# Altium project R5560_Test_Board_rev1.PrjPcb
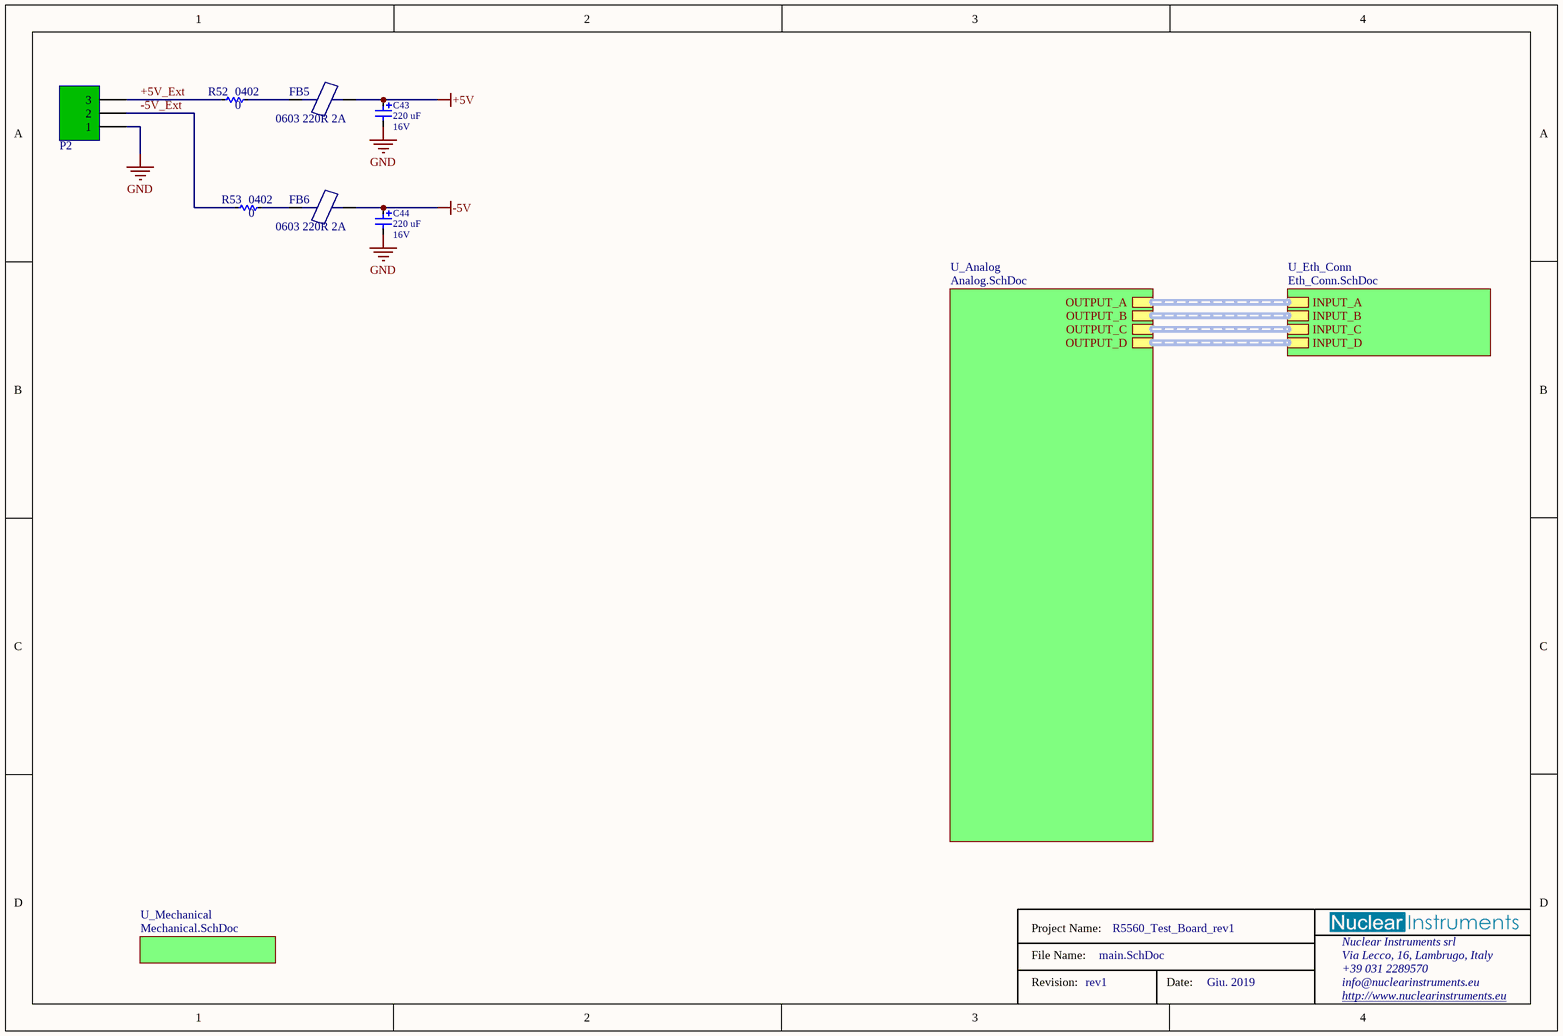
[diagram p0: main.SchDoc]
Data_Revisione: Giu. 2019; Nome_Progetto: R5560_Test_Board_rev1; Numero_Revisione: rev1; SARA_PCB_Number: 01840002887; SARA_Project_Number: 99990000391
8 sheets, 406 parts. Net scope: hierarchical (ports join the sheet entries above them; power ports are global).
Board file: R5560_Test_Board_rev1.PcbDoc
Sheets:
  main.SchDoc
    U_Mechanical = Mechanical.SchDoc
    U_Eth_Conn = Eth_Conn.SchDoc
    U_Analog = Analog.SchDoc
      U_Analog_8Ch_A = Analog_8Ch.SchDoc
        U_4ch_A = 4ch.SchDoc
          U_THS4524_Fully_Diff = THS4524_Fully_Diff.SchDoc
        U_4ch_B = 4ch.SchDoc
          U_THS4524_Fully_Diff = THS4524_Fully_Diff.SchDoc
      U_Analog_8Ch_B = Analog_8Ch.SchDoc
        U_4ch_A = 4ch.SchDoc
          U_THS4524_Fully_Diff = THS4524_Fully_Diff.SchDoc
        U_4ch_B = 4ch.SchDoc
          U_THS4524_Fully_Diff = THS4524_Fully_Diff.SchDoc
      U_Analog_8Ch_C = Analog_8Ch.SchDoc
        U_4ch_A = 4ch.SchDoc
          U_THS4524_Fully_Diff = THS4524_Fully_Diff.SchDoc
        U_4ch_B = 4ch.SchDoc
          U_THS4524_Fully_Diff = THS4524_Fully_Diff.SchDoc
      U_Analog_8Ch_D = Analog_8Ch.SchDoc
        U_4ch_A = 4ch.SchDoc
          U_THS4524_Fully_Diff = THS4524_Fully_Diff.SchDoc
        U_4ch_B = 4ch.SchDoc
          U_THS4524_Fully_Diff = THS4524_Fully_Diff.SchDoc
      VCMG = Vocm_Gen.SchDoc

## Sheet main.SchDoc
size A4; Organization: Altium Limited; Address1: L3, 12a Rodborough Rd; Address2: Frenchs Forest; Address3: NSW; Address4: Australia 2086

### Parts
C43  value 220 uF  Voltage: 16V  [CAPELECTSMD_L83_H62]  (hidden comment: CAPELECT)
C44  value 220 uF  Voltage: 16V  [CAPELECTSMD_L83_H62]  (hidden comment: CAPELECT)
FB5  0603 220R 2A  [FERSMD0603]
FB6  0603 220R 2A  [FERSMD0603]
P2  3 way 5.08mm pitch  [Wurth_2135_3way_5.08mm_screw]  (value not drawn)
R52  0402  value 0  [RESSMD0402]
R53  0402  value 0  [RESSMD0402]

### Sub-sheets
U_Analog = Analog.SchDoc: OUTPUT_D (harness 8ch_sig), OUTPUT_C (harness 8ch_sig), OUTPUT_B (harness 8ch_sig), OUTPUT_A (harness 8ch_sig)
U_Eth_Conn = Eth_Conn.SchDoc: INPUT_D (harness 8ch_sig), INPUT_C (harness 8ch_sig), INPUT_B (harness 8ch_sig), INPUT_A (harness 8ch_sig)
U_Mechanical = Mechanical.SchDoc: no entries

### Nets
+5V: C43.1 FB5.2
-5V: C44.1 FB6.2
GND: C43.2 C44.2 P2.1
+5V_Ext: P2.3 R52.1
-5V_Ext: P2.2 R53.1
NetFB5_1: FB5.1 R52.2
NetFB6_1: FB6.1 R53.2

### Buses and harness runs
harness sheet U_Analog/OUTPUT_A = sheet U_Eth_Conn/INPUT_A
harness sheet U_Analog/OUTPUT_B = sheet U_Eth_Conn/INPUT_B
harness sheet U_Analog/OUTPUT_C = sheet U_Eth_Conn/INPUT_C
harness sheet U_Analog/OUTPUT_D = sheet U_Eth_Conn/INPUT_D

### Notes on the sheet
- Project Name:
- Revision:
- File Name:
- Date:
- Nuclear Instruments srl
- Via Lecco, 16, Lambrugo, Italy
- +39 031 2289570
- info@nuclearinstruments.eu
- http://www.nuclearinstruments.eu

### Library data of the parts
C43 C44 = CAPELECT_PANASONIC_L83_H62_FK_16V_220u: Cond. Elettrolitico Allum.220 µF, 16 V; NICode: 00660000026; NIClass: Standard
FB5 FB6 = FER0603_BLM18EG221SN1D_220R: NICode: 00330000195; Value: 220; NIClass: Standard
P2 = Wurth_2135_3way_5.08mm_screw: Serie 2135- 5.08mm Horizontal Entry Modular w. Rising Cage Clamp WR-TBL; NICode: 00280001645; NIClass: Standard
R52 R53 = RES0402-0R: NICode: 00300000186; NIClass: Standard

## Sheet Mechanical.SchDoc
size A4
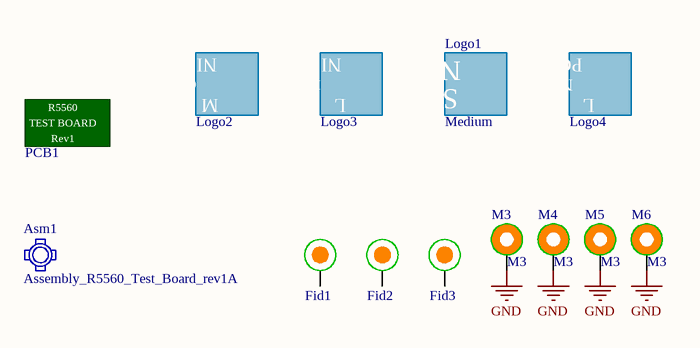
[diagram p1: Mechanical.SchDoc]

### Parts
Asm1  Assembly_R5560_Test_Board_rev1A  (mechanical)
Fid1  PCB_Fiducial_Round_1mm  [PCB_Fiducial_Round_1mm]  (value not drawn)
Fid2  PCB_Fiducial_Round_1mm  [PCB_Fiducial_Round_1mm]  (value not drawn)
Fid3  PCB_Fiducial_Round_1mm  [PCB_Fiducial_Round_1mm]  (value not drawn)
Logo1  Medium  [NI_SN_MEDIUM]
Logo2  NI_COMPLETE_M_LOGO  [NI_COMPLETE_M_LOGO]  (value not drawn)
Logo3  R5560_Test_Board_rev1  [NI_ProjectName_L_Serigraphy]  (value not drawn)
Logo4  PCB_Number_L  [NI_PCB_Number_L_Serigraphy]  (value not drawn)
M3  M3  [PCBPad_M3_Head6mm]
M4  M3  [PCBPad_M3_Head6mm]
M5  M3  [PCBPad_M3_Head6mm]
M6  M3  [PCBPad_M3_Head6mm]
PCB1  PCB_R5560_Test_Board_rev1  (value not drawn)  (mechanical)

### Nets
GND: M3.1 M4.1 M5.1 M6.1

Not connected (* = marked no-connect by the designer): Fid1 1; Fid2 1; Fid3 1

### Notes on the sheet
- Project Name:
- Revision:
- File Name:
- Date:
- Nuclear Instruments srl
- Via Lecco, 16, Lambrugo, Italy
- +39 031 2289570
- info@nuclearinstruments.eu
- http://www.nuclearinstruments.eu
- (in symbol NI_COMPLETE_M_LOGO) NI; Complete; M
- (in symbol NI_PCB_Number_L_Serigraphy) PCB; Number; L
- (in symbol NI_ProjectName_L_Serigraphy) NI; Proj Name; L
- (in symbol NI_SN_MEDIUM) NI; SN
- (in symbol PCB_R5560_Test_Board_rev1) R5560; TEST BOARD; Rev1

### Library data of the parts
Asm1 = Assembly_R5560_Test_Board_rev1A: NICode: 02960002888; NIClass: AssemblyJob
Fid1-Fid3 = PCB_Fiducial_Round_1mm: NICode: 01250000389; NIClass: Fiducial
Logo1 = NI_SN_MEDIUM: NICode: 03230002376; NIClass: ProjectSN
Logo2 = NI_COMPLETE_M_LOGO: NICode: 03230002372; NIClass: Logo
Logo3 = NI_ProjectName_L_Serigraphy: NICode: 03230002445; NIClass: ProjectName
Logo4 = NI_PCB_Number_L_Serigraphy: NICode: 03230002907; NIClass: PCBNumber
M3-M6 = PCBPad_M3_Head6mm: NICode: 01250000388; NIClass: PCBPad
PCB1 = PCB_R5560_Test_Board_rev1: NICode: 01840002887; NIClass: PCB

## Sheet Eth_Conn.SchDoc
size A4; Organization: Altium Limited; Address1: L3, 12a Rodborough Rd; Address2: Frenchs Forest; Address3: NSW; Address4: Australia 2086
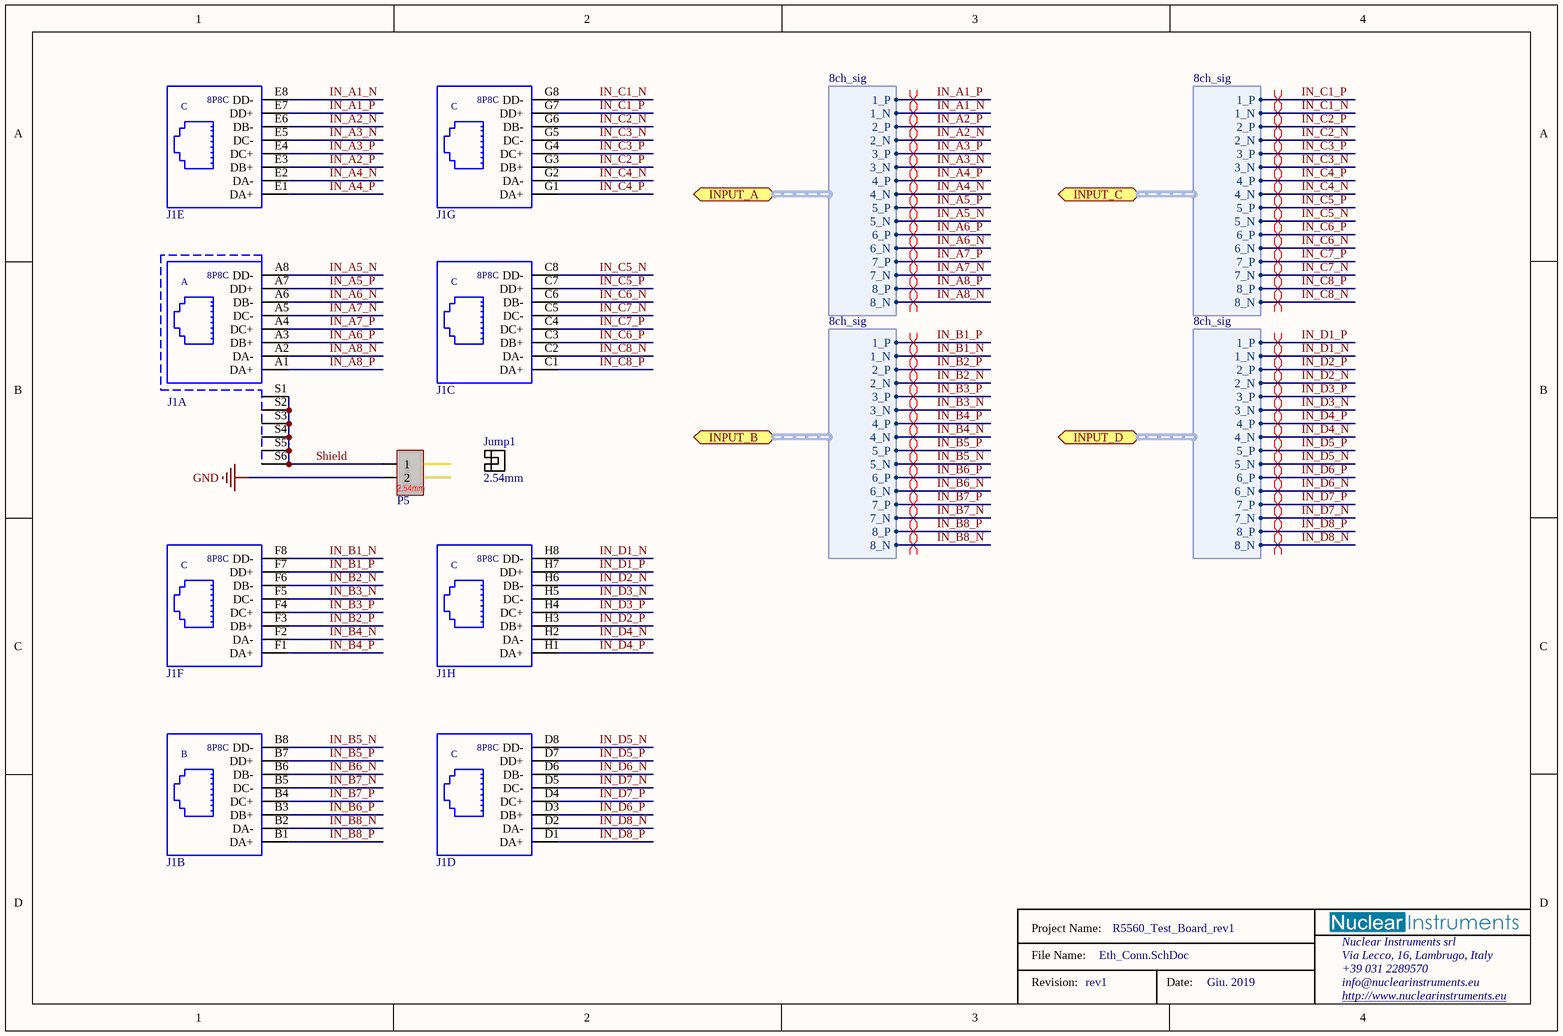
[diagram p2: Eth_Conn.SchDoc]

### Parts
J1  Wurth_WR-MJ_RJ45_2x4_615064243321  [Wurth_WR-MJ_RJ45_2x4_615064243321]  (value not drawn)  (parts A,B,C,D,E,F,G,H of 8)
Jump1  2.54mm  (mechanical)
P5  Wurth_WR-PHD_2way_2.54mm_male  [Wurth_WR-PHD_2way_2.54mm_male]  (value not drawn)

### Ports
INPUT_A (harness 8ch_sig), INPUT_B (harness 8ch_sig), INPUT_C (harness 8ch_sig), INPUT_D (harness 8ch_sig)

### Harnesses
8ch_sig: 1_P, 1_N, 2_P, 2_N, 3_P, 3_N, 4_P, 4_N, 5_P, 5_N, 6_P, 6_N, 7_P, 7_N, 8_P, 8_N

### Nets
GND: P5.2
IN_A1_N: J1.E8(DD-) ; port INPUT_A.1_N
IN_A1_P: J1.E7(DD+) ; port INPUT_A.1_P
IN_A2_N: J1.E6(DB-) ; port INPUT_A.2_N
IN_A2_P: J1.E3(DB+) ; port INPUT_A.2_P
IN_A3_N: J1.E5(DC-) ; port INPUT_A.3_N
IN_A3_P: J1.E4(DC+) ; port INPUT_A.3_P
IN_A4_N: J1.E2(DA-) ; port INPUT_A.4_N
IN_A4_P: J1.E1(DA+) ; port INPUT_A.4_P
IN_A5_N: J1.A8(DD-) ; port INPUT_A.5_N
IN_A5_P: J1.A7(DD+) ; port INPUT_A.5_P
IN_A6_N: J1.A6(DB-) ; port INPUT_A.6_N
IN_A6_P: J1.A3(DB+) ; port INPUT_A.6_P
IN_A7_N: J1.A5(DC-) ; port INPUT_A.7_N
IN_A7_P: J1.A4(DC+) ; port INPUT_A.7_P
IN_A8_N: J1.A2(DA-) ; port INPUT_A.8_N
IN_A8_P: J1.A1(DA+) ; port INPUT_A.8_P
IN_B1_N: J1.F8(DD-) ; port INPUT_B.1_N
IN_B1_P: J1.F7(DD+) ; port INPUT_B.1_P
IN_B2_N: J1.F6(DB-) ; port INPUT_B.2_N
IN_B2_P: J1.F3(DB+) ; port INPUT_B.2_P
IN_B3_N: J1.F5(DC-) ; port INPUT_B.3_N
IN_B3_P: J1.F4(DC+) ; port INPUT_B.3_P
IN_B4_N: J1.F2(DA-) ; port INPUT_B.4_N
IN_B4_P: J1.F1(DA+) ; port INPUT_B.4_P
IN_B5_N: J1.B8(DD-) ; port INPUT_B.5_N
IN_B5_P: J1.B7(DD+) ; port INPUT_B.5_P
IN_B6_N: J1.B6(DB-) ; port INPUT_B.6_N
IN_B6_P: J1.B3(DB+) ; port INPUT_B.6_P
IN_B7_N: J1.B5(DC-) ; port INPUT_B.7_N
IN_B7_P: J1.B4(DC+) ; port INPUT_B.7_P
IN_B8_N: J1.B2(DA-) ; port INPUT_B.8_N
IN_B8_P: J1.B1(DA+) ; port INPUT_B.8_P
IN_C1_N: J1.G8(DD-) ; port INPUT_C.1_N
IN_C1_P: J1.G7(DD+) ; port INPUT_C.1_P
IN_C2_N: J1.G6(DB-) ; port INPUT_C.2_N
IN_C2_P: J1.G3(DB+) ; port INPUT_C.2_P
IN_C3_N: J1.G5(DC-) ; port INPUT_C.3_N
IN_C3_P: J1.G4(DC+) ; port INPUT_C.3_P
IN_C4_N: J1.G2(DA-) ; port INPUT_C.4_N
IN_C4_P: J1.G1(DA+) ; port INPUT_C.4_P
IN_C5_N: J1.C8(DD-) ; port INPUT_C.5_N
IN_C5_P: J1.C7(DD+) ; port INPUT_C.5_P
IN_C6_N: J1.C6(DB-) ; port INPUT_C.6_N
IN_C6_P: J1.C3(DB+) ; port INPUT_C.6_P
IN_C7_N: J1.C5(DC-) ; port INPUT_C.7_N
IN_C7_P: J1.C4(DC+) ; port INPUT_C.7_P
IN_C8_N: J1.C2(DA-) ; port INPUT_C.8_N
IN_C8_P: J1.C1(DA+) ; port INPUT_C.8_P
IN_D1_N: J1.H8(DD-) ; port INPUT_D.1_N
IN_D1_P: J1.H7(DD+) ; port INPUT_D.1_P
IN_D2_N: J1.H6(DB-) ; port INPUT_D.2_N
IN_D2_P: J1.H3(DB+) ; port INPUT_D.2_P
IN_D3_N: J1.H5(DC-) ; port INPUT_D.3_N
IN_D3_P: J1.H4(DC+) ; port INPUT_D.3_P
IN_D4_N: J1.H2(DA-) ; port INPUT_D.4_N
IN_D4_P: J1.H1(DA+) ; port INPUT_D.4_P
IN_D5_N: J1.D8(DD-) ; port INPUT_D.5_N
IN_D5_P: J1.D7(DD+) ; port INPUT_D.5_P
IN_D6_N: J1.D6(DB-) ; port INPUT_D.6_N
IN_D6_P: J1.D3(DB+) ; port INPUT_D.6_P
IN_D7_N: J1.D5(DC-) ; port INPUT_D.7_N
IN_D7_P: J1.D4(DC+) ; port INPUT_D.7_P
IN_D8_N: J1.D2(DA-) ; port INPUT_D.8_N
IN_D8_P: J1.D1(DA+) ; port INPUT_D.8_P
Shield: J1.S1 J1.S2 J1.S3 J1.S4 J1.S5 J1.S6 P5.1

### Layout directives
differential pair: IN_A1_N, IN_A1_P, IN_A2_N, IN_A2_P, IN_A3_N, IN_A3_P, IN_A4_N, IN_A4_P, IN_A5_N, IN_A5_P, IN_A6_N, IN_A6_P, IN_A7_N, IN_A7_P, IN_A8_N, IN_A8_P, IN_B1_N, IN_B1_P, IN_B2_N, IN_B2_P, IN_B3_N, IN_B3_P, IN_B4_N, IN_B4_P, IN_B5_N, IN_B5_P, IN_B6_N, IN_B6_P, IN_B7_N, IN_B7_P, IN_B8_N, IN_B8_P, IN_C1_N, IN_C1_P, IN_C2_N, IN_C2_P, IN_C3_N, IN_C3_P, IN_C4_N, IN_C4_P, IN_C5_N, IN_C5_P, IN_C6_N, IN_C6_P, IN_C7_N, IN_C7_P, IN_C8_N, IN_C8_P, IN_D1_N, IN_D1_P, IN_D2_N, IN_D2_P, IN_D3_N, IN_D3_P, IN_D4_N, IN_D4_P, IN_D5_N, IN_D5_P, IN_D6_N, IN_D6_P, IN_D7_N, IN_D7_P, IN_D8_N, IN_D8_P

### Notes on the sheet
- Project Name:
- Revision:
- File Name:
- Date:
- Nuclear Instruments srl
- Via Lecco, 16, Lambrugo, Italy
- +39 031 2289570
- info@nuclearinstruments.eu
- http://www.nuclearinstruments.eu
- (in symbol Wurth_WR-MJ_RJ45_2x4_615064243321, part A) 8P8C; A
- (in symbol Wurth_WR-MJ_RJ45_2x4_615064243321, part B) 8P8C; B
- (in symbol Wurth_WR-MJ_RJ45_2x4_615064243321, part C) 8P8C; C
- (in symbol Wurth_WR-MJ_RJ45_2x4_615064243321, part D) 8P8C; C
- (in symbol Wurth_WR-MJ_RJ45_2x4_615064243321, part E) 8P8C; C
- (in symbol Wurth_WR-MJ_RJ45_2x4_615064243321, part F) 8P8C; C
- (in symbol Wurth_WR-MJ_RJ45_2x4_615064243321, part G) 8P8C; C
- (in symbol Wurth_WR-MJ_RJ45_2x4_615064243321, part H) 8P8C; C
- (in symbol Wurth_WR-PHD_2way_2.54mm_male) 2.54mm

### Library data of the parts
J1 = Wurth_WR-MJ_RJ45_2x4_615064243321: RJ45 Modular Jack 2x4; NICode: 00280001692; NIClass: Standard
Jump1 = SNT-100-BK-G: NICode: 01510000699; NIClass: Jumpers
P5 = Wurth_WR-PHD_2way_2.54mm_male: Male 2 way 2.54 mm; NICode: 00280000455; NIClass: Standard

## Sheet Analog.SchDoc
size A4; Organization: Altium Limited; Address1: L3, 12a Rodborough Rd; Address2: Frenchs Forest; Address3: NSW; Address4: Australia 2086
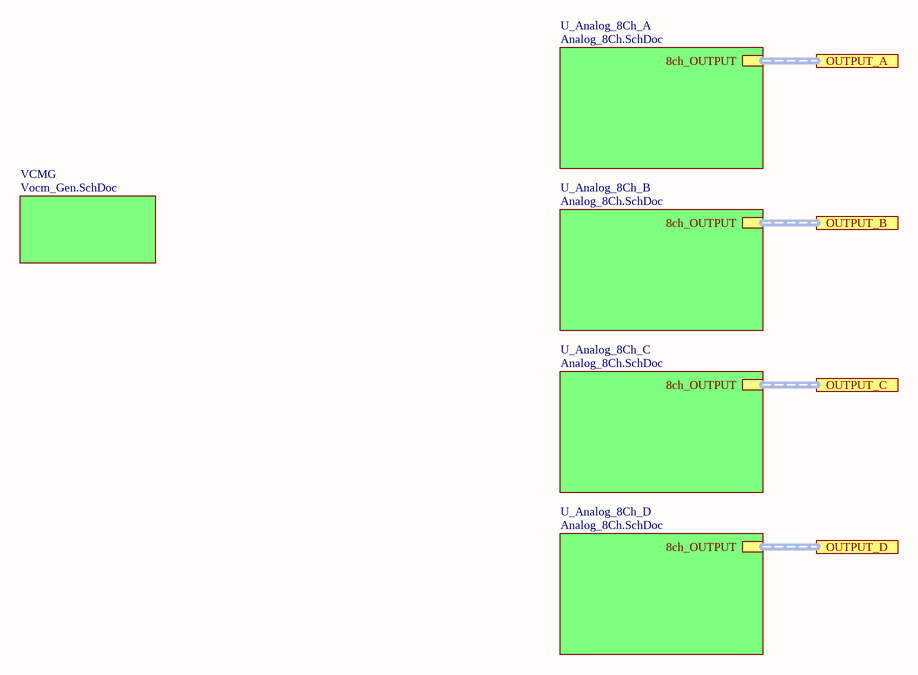
[diagram p3: Analog.SchDoc]

### Sub-sheets
U_Analog_8Ch_A = Analog_8Ch.SchDoc: 8ch_OUTPUT (harness 8ch_sig)
U_Analog_8Ch_B = Analog_8Ch.SchDoc: 8ch_OUTPUT (harness 8ch_sig)
U_Analog_8Ch_C = Analog_8Ch.SchDoc: 8ch_OUTPUT (harness 8ch_sig)
U_Analog_8Ch_D = Analog_8Ch.SchDoc: 8ch_OUTPUT (harness 8ch_sig)
VCMG = Vocm_Gen.SchDoc: no entries

### Ports
OUTPUT_A (harness 8ch_sig), OUTPUT_B (harness 8ch_sig), OUTPUT_C (harness 8ch_sig), OUTPUT_D (harness 8ch_sig)

### Buses and harness runs
harness port OUTPUT_A = sheet U_Analog_8Ch_A/8ch_OUTPUT
harness port OUTPUT_B = sheet U_Analog_8Ch_B/8ch_OUTPUT
harness port OUTPUT_C = sheet U_Analog_8Ch_C/8ch_OUTPUT
harness port OUTPUT_D = sheet U_Analog_8Ch_D/8ch_OUTPUT

### Notes on the sheet
- Project Name:
- Revision:
- File Name:
- Date:
- Nuclear Instruments srl
- Via Lecco, 16, Lambrugo, Italy
- +39 031 2289570
- info@nuclearinstruments.eu
- http://www.nuclearinstruments.eu

## Sheet Analog_8Ch.SchDoc
size A4; Organization: Altium Limited; Address1: L3, 12a Rodborough Rd; Address2: Frenchs Forest; Address3: NSW; Address4: Australia 2086
Used 4 times, as channels U_Analog/U_Analog_8Ch_A, U_Analog/U_Analog_8Ch_B, U_Analog/U_Analog_8Ch_C, U_Analog/U_Analog_8Ch_D. Parts and nets are listed once, with the designators drawn on the sheet.
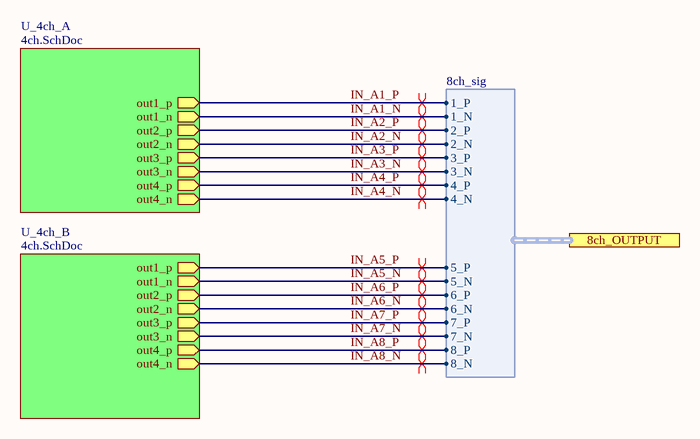
[diagram p4: Analog_8Ch.SchDoc]

### Sub-sheets
U_4ch_A = 4ch.SchDoc: out4_p (out), out1_n (out), out2_p (out), out1_p (out), out2_n (out), out3_n (out), out3_p (out), out4_n (out)
U_4ch_B = 4ch.SchDoc: out4_p (out), out1_n (out), out2_p (out), out1_p (out), out2_n (out), out3_n (out), out3_p (out), out4_n (out)

### Ports
8ch_OUTPUT (harness 8ch_sig)

### Harnesses
8ch_sig: 1_P, 1_N, 2_P, 2_N, 3_P, 3_N, 4_P, 4_N, 5_P, 5_N, 6_P, 6_N, 7_P, 7_N, 8_P, 8_N

### Nets
IN_A1_N: sheet U_4ch_A/out1_n, port 8ch_OUTPUT.1_N
IN_A1_P: sheet U_4ch_A/out1_p, port 8ch_OUTPUT.1_P
IN_A2_N: sheet U_4ch_A/out2_n, port 8ch_OUTPUT.2_N
IN_A2_P: sheet U_4ch_A/out2_p, port 8ch_OUTPUT.2_P
IN_A3_N: sheet U_4ch_A/out3_n, port 8ch_OUTPUT.3_N
IN_A3_P: sheet U_4ch_A/out3_p, port 8ch_OUTPUT.3_P
IN_A4_N: sheet U_4ch_A/out4_n, port 8ch_OUTPUT.4_N
IN_A4_P: sheet U_4ch_A/out4_p, port 8ch_OUTPUT.4_P
IN_A5_N: sheet U_4ch_B/out1_n, port 8ch_OUTPUT.5_N
IN_A5_P: sheet U_4ch_B/out1_p, port 8ch_OUTPUT.5_P
IN_A6_N: sheet U_4ch_B/out2_n, port 8ch_OUTPUT.6_N
IN_A6_P: sheet U_4ch_B/out2_p, port 8ch_OUTPUT.6_P
IN_A7_N: sheet U_4ch_B/out3_n, port 8ch_OUTPUT.7_N
IN_A7_P: sheet U_4ch_B/out3_p, port 8ch_OUTPUT.7_P
IN_A8_N: sheet U_4ch_B/out4_n, port 8ch_OUTPUT.8_N
IN_A8_P: sheet U_4ch_B/out4_p, port 8ch_OUTPUT.8_P

### Channels
U_Analog/U_Analog_8Ch_A: no parts or ports
U_Analog/U_Analog_8Ch_B: no parts or ports
U_Analog/U_Analog_8Ch_C: no parts or ports
U_Analog/U_Analog_8Ch_D: no parts or ports

### Layout directives
differential pair: IN_A1_N, IN_A1_P, IN_A2_N, IN_A2_P, IN_A3_N, IN_A3_P, IN_A4_N, IN_A4_P, IN_A5_N, IN_A5_P, IN_A6_N, IN_A6_P, IN_A7_N, IN_A7_P, IN_A8_N, IN_A8_P

### Notes on the sheet
- Project Name:
- Revision:
- File Name:
- Date:
- Nuclear Instruments srl
- Via Lecco, 16, Lambrugo, Italy
- +39 031 2289570
- info@nuclearinstruments.eu
- http://www.nuclearinstruments.eu

## Sheet 4ch.SchDoc
size A4; Organization: Altium Limited; Address1: L3, 12a Rodborough Rd; Address2: Frenchs Forest; Address3: NSW; Address4: Australia 2086
Used 8 times, as channels U_Analog/U_Analog_8Ch_A/U_4ch_A, U_Analog/U_Analog_8Ch_A/U_4ch_B, U_Analog/U_Analog_8Ch_B/U_4ch_A, U_Analog/U_Analog_8Ch_B/U_4ch_B, U_Analog/U_Analog_8Ch_C/U_4ch_A, U_Analog/U_Analog_8Ch_C/U_4ch_B, U_Analog/U_Analog_8Ch_D/U_4ch_A, U_Analog/U_Analog_8Ch_D/U_4ch_B. Parts and nets are listed once, with the designators drawn on the sheet.
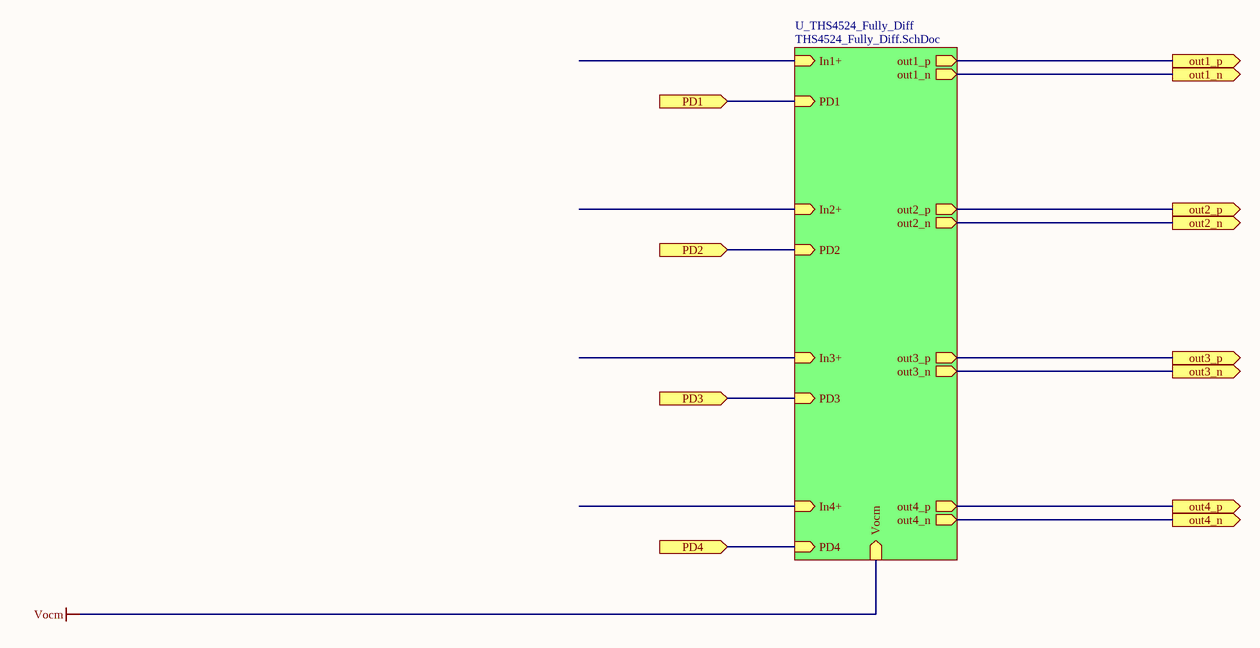
[diagram p5: 4ch.SchDoc]

### Sub-sheets
U_THS4524_Fully_Diff = THS4524_Fully_Diff.SchDoc: Vocm (in), out3_p (out), out3_n (out), out2_p (out), out2_n (out), out1_p (out), out1_n (out), out4_p (out), out4_n (out), In1+ (in), In2+ (in), In3+ (in), In4+ (in), PD1 (in), PD3 (in), PD2 (in), PD4 (in)

### Ports
out1_n (out), out1_p (out), out2_n (out), out2_p (out), out3_n (out), out3_p (out), out4_n (out), out4_p (out), PD1 (in), PD2 (in), PD3 (in), PD4 (in)

### Nets
out1_n: port out1_n, sheet U_THS4524_Fully_Diff/out1_n
out1_p: port out1_p, sheet U_THS4524_Fully_Diff/out1_p
out2_n: port out2_n, sheet U_THS4524_Fully_Diff/out2_n
out2_p: port out2_p, sheet U_THS4524_Fully_Diff/out2_p
out3_n: port out3_n, sheet U_THS4524_Fully_Diff/out3_n
out3_p: port out3_p, sheet U_THS4524_Fully_Diff/out3_p
out4_n: port out4_n, sheet U_THS4524_Fully_Diff/out4_n
out4_p: port out4_p, sheet U_THS4524_Fully_Diff/out4_p
PD1: port PD1, sheet U_THS4524_Fully_Diff/PD1
PD2: port PD2, sheet U_THS4524_Fully_Diff/PD2
PD3: port PD3, sheet U_THS4524_Fully_Diff/PD3
PD4: port PD4, sheet U_THS4524_Fully_Diff/PD4

### Channels
U_Analog/U_Analog_8Ch_A/U_4ch_A: ports out1_n=IN_A1_N out1_p=IN_A1_P out2_n=IN_A2_N out2_p=IN_A2_P out3_n=IN_A3_N out3_p=IN_A3_P out4_n=IN_A4_N out4_p=IN_A4_P PD1=PD1_U_THS4524_Fully_Diff PD2=PD2_U_THS4524_Fully_Diff PD3=PD3_U_THS4524_Fully_Diff PD4=PD4_U_THS4524_Fully_Diff
U_Analog/U_Analog_8Ch_A/U_4ch_B: ports out1_n=IN_A5_N out1_p=IN_A5_P out2_n=IN_A6_N out2_p=IN_A6_P out3_n=IN_A7_N out3_p=IN_A7_P out4_n=IN_A8_N out4_p=IN_A8_P PD1=PD1_U_THS4524_Fully_Diff PD2=PD2_U_THS4524_Fully_Diff PD3=PD3_U_THS4524_Fully_Diff PD4=PD4_U_THS4524_Fully_Diff
U_Analog/U_Analog_8Ch_B/U_4ch_A: ports out1_n=IN_B1_N out1_p=IN_B1_P out2_n=IN_B2_N out2_p=IN_B2_P out3_n=IN_B3_N out3_p=IN_B3_P out4_n=IN_B4_N out4_p=IN_B4_P PD1=PD1_U_THS4524_Fully_Diff PD2=PD2_U_THS4524_Fully_Diff PD3=PD3_U_THS4524_Fully_Diff PD4=PD4_U_THS4524_Fully_Diff
U_Analog/U_Analog_8Ch_B/U_4ch_B: ports out1_n=IN_B5_N out1_p=IN_B5_P out2_n=IN_B6_N out2_p=IN_B6_P out3_n=IN_B7_N out3_p=IN_B7_P out4_n=IN_B8_N out4_p=IN_B8_P PD1=PD1_U_THS4524_Fully_Diff PD2=PD2_U_THS4524_Fully_Diff PD3=PD3_U_THS4524_Fully_Diff PD4=PD4_U_THS4524_Fully_Diff
U_Analog/U_Analog_8Ch_C/U_4ch_A: ports out1_n=IN_C1_N out1_p=IN_C1_P out2_n=IN_C2_N out2_p=IN_C2_P out3_n=IN_C3_N out3_p=IN_C3_P out4_n=IN_C4_N out4_p=IN_C4_P PD1=PD1_U_THS4524_Fully_Diff PD2=PD2_U_THS4524_Fully_Diff PD3=PD3_U_THS4524_Fully_Diff PD4=PD4_U_THS4524_Fully_Diff
U_Analog/U_Analog_8Ch_C/U_4ch_B: ports out1_n=IN_C5_N out1_p=IN_C5_P out2_n=IN_C6_N out2_p=IN_C6_P out3_n=IN_C7_N out3_p=IN_C7_P out4_n=IN_C8_N out4_p=IN_C8_P PD1=PD1_U_THS4524_Fully_Diff PD2=PD2_U_THS4524_Fully_Diff PD3=PD3_U_THS4524_Fully_Diff PD4=PD4_U_THS4524_Fully_Diff
U_Analog/U_Analog_8Ch_D/U_4ch_A: ports out1_n=IN_D1_N out1_p=IN_D1_P out2_n=IN_D2_N out2_p=IN_D2_P out3_n=IN_D3_N out3_p=IN_D3_P out4_n=IN_D4_N out4_p=IN_D4_P PD1=PD1_U_THS4524_Fully_Diff PD2=PD2_U_THS4524_Fully_Diff PD3=PD3_U_THS4524_Fully_Diff PD4=PD4_U_THS4524_Fully_Diff
U_Analog/U_Analog_8Ch_D/U_4ch_B: ports out1_n=IN_D5_N out1_p=IN_D5_P out2_n=IN_D6_N out2_p=IN_D6_P out3_n=IN_D7_N out3_p=IN_D7_P out4_n=IN_D8_N out4_p=IN_D8_P PD1=PD1_U_THS4524_Fully_Diff PD2=PD2_U_THS4524_Fully_Diff PD3=PD3_U_THS4524_Fully_Diff PD4=PD4_U_THS4524_Fully_Diff

### Notes on the sheet
- Project Name:
- Revision:
- File Name:
- Date:
- Nuclear Instruments srl
- Via Lecco, 16, Lambrugo, Italy
- +39 031 2289570
- info@nuclearinstruments.eu
- http://www.nuclearinstruments.eu

## Sheet THS4524_Fully_Diff.SchDoc
size A3; Organization: Altium Limited; Address1: L3, 12a Rodborough Rd; Address2: Frenchs Forest; Address3: NSW; Address4: Australia 2086
Used 8 times, as channels U_Analog/U_Analog_8Ch_A/U_4ch_A/U_THS4524_Fully_Diff, U_Analog/U_Analog_8Ch_A/U_4ch_B/U_THS4524_Fully_Diff, U_Analog/U_Analog_8Ch_B/U_4ch_A/U_THS4524_Fully_Diff, U_Analog/U_Analog_8Ch_B/U_4ch_B/U_THS4524_Fully_Diff, U_Analog/U_Analog_8Ch_C/U_4ch_A/U_THS4524_Fully_Diff, U_Analog/U_Analog_8Ch_C/U_4ch_B/U_THS4524_Fully_Diff, U_Analog/U_Analog_8Ch_D/U_4ch_A/U_THS4524_Fully_Diff, U_Analog/U_Analog_8Ch_D/U_4ch_B/U_THS4524_Fully_Diff. Parts and nets are listed once, with the designators drawn on the sheet.
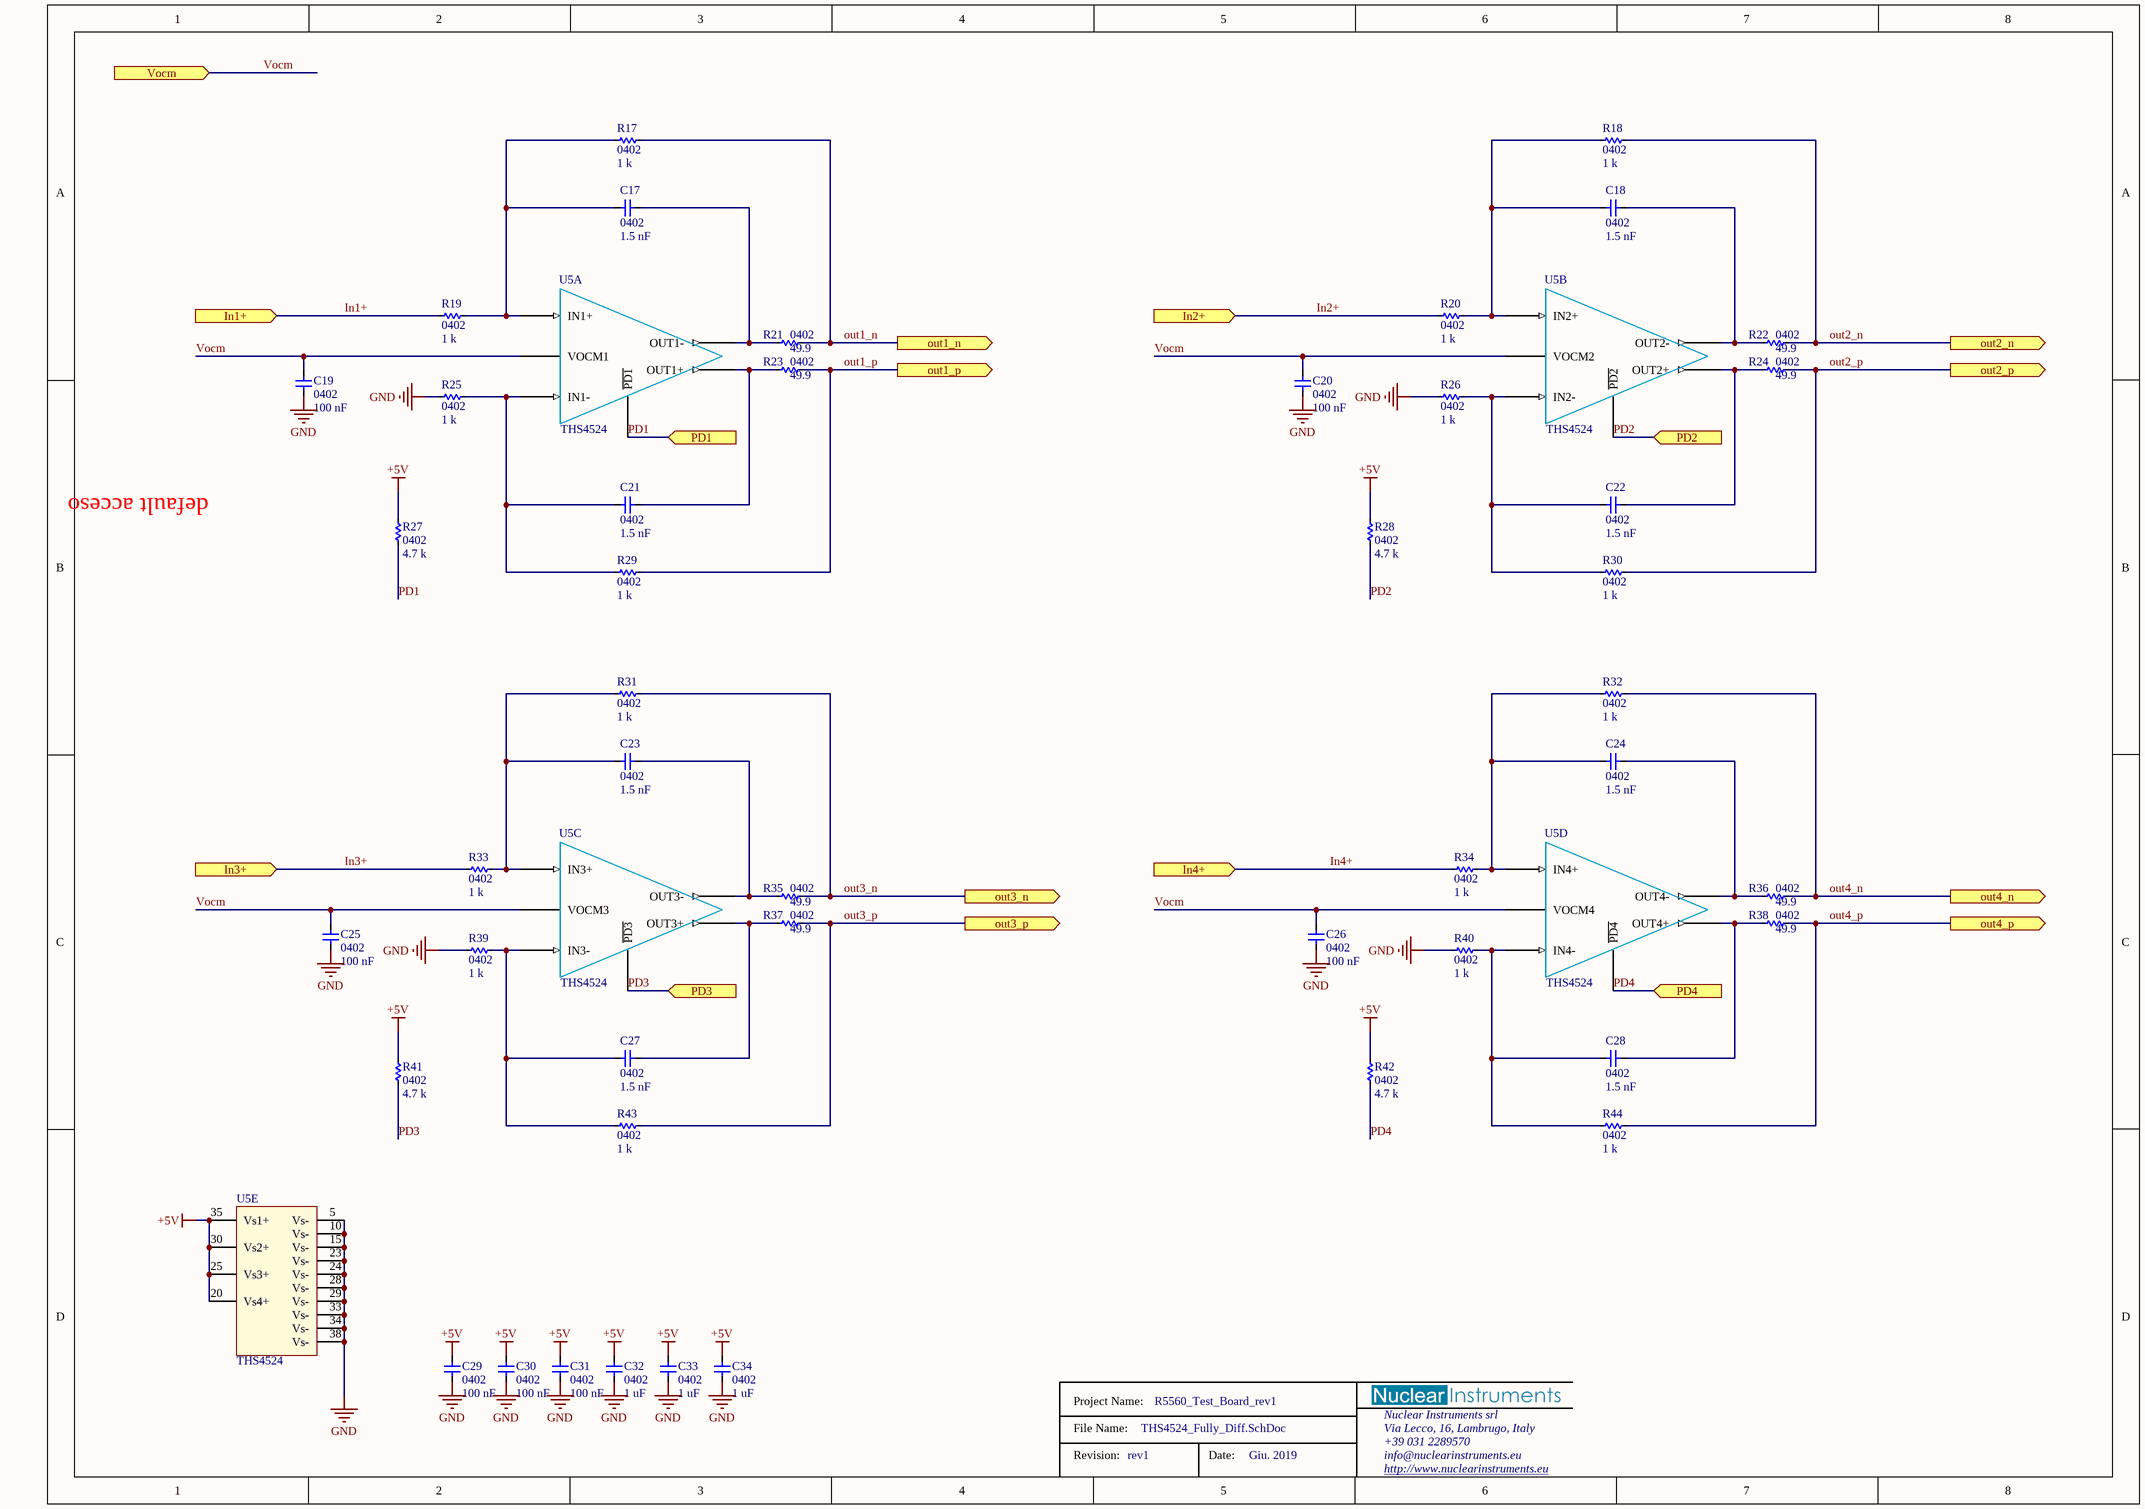
[diagram p6: THS4524_Fully_Diff.SchDoc]

### Parts
C17  0402  value 1.5 nF  [CAPCERSMD0402]
C18  0402  value 1.5 nF  [CAPCERSMD0402]
C19  0402  value 100 nF  [CAPCERSMD0402]
C20  0402  value 100 nF  [CAPCERSMD0402]
C21  0402  value 1.5 nF  [CAPCERSMD0402]
C22  0402  value 1.5 nF  [CAPCERSMD0402]
C23  0402  value 1.5 nF  [CAPCERSMD0402]
C24  0402  value 1.5 nF  [CAPCERSMD0402]
C25  0402  value 100 nF  [CAPCERSMD0402]
C26  0402  value 100 nF  [CAPCERSMD0402]
C27  0402  value 1.5 nF  [CAPCERSMD0402]
C28  0402  value 1.5 nF  [CAPCERSMD0402]
C29  0402  value 100 nF  [CAPCERSMD0402]
C30  0402  value 100 nF  [CAPCERSMD0402]
C31  0402  value 100 nF  [CAPCERSMD0402]
C32  0402  value 1 uF  [CAPCERSMD0402]
C33  0402  value 1 uF  [CAPCERSMD0402]
C34  0402  value 1 uF  [CAPCERSMD0402]
R17  0402  value 1 k  [RESSMD0402]
R18  0402  value 1 k  [RESSMD0402]
R19  0402  value 1 k  [RESSMD0402]
R20  0402  value 1 k  [RESSMD0402]
R21  0402  value 49.9  [RESSMD0402]
R22  0402  value 49.9  [RESSMD0402]
R23  0402  value 49.9  [RESSMD0402]
R24  0402  value 49.9  [RESSMD0402]
R25  0402  value 1 k  [RESSMD0402]
R26  0402  value 1 k  [RESSMD0402]
R27  0402  value 4.7 k  [RESSMD0402]
R28  0402  value 4.7 k  [RESSMD0402]
R29  0402  value 1 k  [RESSMD0402]
R30  0402  value 1 k  [RESSMD0402]
R31  0402  value 1 k  [RESSMD0402]
R32  0402  value 1 k  [RESSMD0402]
R33  0402  value 1 k  [RESSMD0402]
R34  0402  value 1 k  [RESSMD0402]
R35  0402  value 49.9  [RESSMD0402]
R36  0402  value 49.9  [RESSMD0402]
R37  0402  value 49.9  [RESSMD0402]
R38  0402  value 49.9  [RESSMD0402]
R39  0402  value 1 k  [RESSMD0402]
R40  0402  value 1 k  [RESSMD0402]
R41  0402  value 4.7 k  [RESSMD0402]
R42  0402  value 4.7 k  [RESSMD0402]
R43  0402  value 1 k  [RESSMD0402]
R44  0402  value 1 k  [RESSMD0402]
U5  THS4524  [SOP38_P50W640L970H120]  (parts A,B,C,D,E of 5)

### Ports
In1+ (in), In2+ (in), In3+ (in), In4+ (in), out1_n (out), out1_p (out), out2_n (out), out2_p (out), out3_n (out), out3_p (out), out4_n (out), out4_p (out), PD1 (in), PD2 (in), PD3 (in), PD4 (in), Vocm (in)

### Nets
+5V: C29.2 C30.2 C31.2 C32.2 C33.2 C34.2 R27.1 R28.1 R41.1 R42.1 U5.20(Vs4+) U5.25(Vs3+) U5.30(Vs2+) U5.35(Vs1+)
GND: C19.1 C20.1 C25.1 C26.1 C29.1 C30.1 C31.1 C32.1 C33.1 C34.1 R25.1 R26.1 R39.1 R40.1 U5.5(Vs-) U5.10(Vs-) U5.15(Vs-) U5.23(Vs-) U5.24(Vs-) U5.28(Vs-) U5.29(Vs-) U5.33(Vs-) U5.34(Vs-) U5.38(Vs-)
In1+: R19.1 ; port In1+
In2+: R20.1 ; port In2+
In3+: R33.1 ; port In3+
In4+: R34.1 ; port In4+
out1_n: R17.2 R21.2 ; port out1_n
out1_p: R23.2 R29.2 ; port out1_p
out2_n: R18.2 R22.2 ; port out2_n
out2_p: R24.2 R30.2 ; port out2_p
out3_n: R31.2 R35.2 ; port out3_n
out3_p: R37.2 R43.2 ; port out3_p
out4_n: R32.2 R36.2 ; port out4_n
out4_p: R38.2 R44.2 ; port out4_p
PD1: R27.2 U5.1(~{PD1}) ; port PD1
PD2: R28.2 U5.6(~{PD2}) ; port PD2
PD3: R41.2 U5.11(~{PD3}) ; port PD3
PD4: R42.2 U5.16(~{PD4}) ; port PD4
Vocm: C19.2 C20.2 C25.2 C26.2 U5.4(VOCM1) U5.9(VOCM2) U5.14(VOCM3) U5.19(VOCM4) ; port Vocm
NetC17_1: C17.1 R21.1 U5.37(OUT1-)
NetC17_2: C17.2 R17.1 R19.2 U5.2(IN1+)
NetC18_1: C18.1 R22.1 U5.32(OUT2-)
NetC18_2: C18.2 R18.1 R20.2 U5.7(IN2+)
NetC21_1: C21.1 R23.1 U5.36(OUT1+)
NetC21_2: C21.2 R25.2 R29.1 U5.3(IN1-)
NetC22_1: C22.1 R24.1 U5.31(OUT2+)
NetC22_2: C22.2 R26.2 R30.1 U5.8(IN2-)
NetC23_1: C23.1 R35.1 U5.27(OUT3-)
NetC23_2: C23.2 R31.1 R33.2 U5.12(IN3+)
NetC24_1: C24.1 R36.1 U5.22(OUT4-)
NetC24_2: C24.2 R32.1 R34.2 U5.17(IN4+)
NetC27_1: C27.1 R37.1 U5.26(OUT3+)
NetC27_2: C27.2 R39.2 R43.1 U5.13(IN3-)
NetC28_1: C28.1 R38.1 U5.21(OUT4+)
NetC28_2: C28.2 R40.2 R44.1 U5.18(IN4-)

### Channels
U_Analog/U_Analog_8Ch_A/U_4ch_A/U_THS4524_Fully_Diff: designators end in _1; ports In1+=In1+_U_THS4524_Fully_Diff In2+=In2+_U_THS4524_Fully_Diff In3+=In3+_U_THS4524_Fully_Diff In4+=In4+_U_THS4524_Fully_Diff out1_n=IN_A1_N out1_p=IN_A1_P out2_n=IN_A2_N out2_p=IN_A2_P out3_n=IN_A3_N out3_p=IN_A3_P out4_n=IN_A4_N out4_p=IN_A4_P PD1=PD1_U_THS4524_Fully_Diff PD2=PD2_U_THS4524_Fully_Diff PD3=PD3_U_THS4524_Fully_Diff PD4=PD4_U_THS4524_Fully_Diff Vocm=Vocm
U_Analog/U_Analog_8Ch_A/U_4ch_B/U_THS4524_Fully_Diff: designators end in _2; ports In1+=In1+_U_THS4524_Fully_Diff In2+=In2+_U_THS4524_Fully_Diff In3+=In3+_U_THS4524_Fully_Diff In4+=In4+_U_THS4524_Fully_Diff out1_n=IN_A5_N out1_p=IN_A5_P out2_n=IN_A6_N out2_p=IN_A6_P out3_n=IN_A7_N out3_p=IN_A7_P out4_n=IN_A8_N out4_p=IN_A8_P PD1=PD1_U_THS4524_Fully_Diff PD2=PD2_U_THS4524_Fully_Diff PD3=PD3_U_THS4524_Fully_Diff PD4=PD4_U_THS4524_Fully_Diff Vocm=Vocm
U_Analog/U_Analog_8Ch_B/U_4ch_A/U_THS4524_Fully_Diff: designators end in _3; ports In1+=In1+_U_THS4524_Fully_Diff In2+=In2+_U_THS4524_Fully_Diff In3+=In3+_U_THS4524_Fully_Diff In4+=In4+_U_THS4524_Fully_Diff out1_n=IN_B1_N out1_p=IN_B1_P out2_n=IN_B2_N out2_p=IN_B2_P out3_n=IN_B3_N out3_p=IN_B3_P out4_n=IN_B4_N out4_p=IN_B4_P PD1=PD1_U_THS4524_Fully_Diff PD2=PD2_U_THS4524_Fully_Diff PD3=PD3_U_THS4524_Fully_Diff PD4=PD4_U_THS4524_Fully_Diff Vocm=Vocm
U_Analog/U_Analog_8Ch_B/U_4ch_B/U_THS4524_Fully_Diff: designators end in _4; ports In1+=In1+_U_THS4524_Fully_Diff In2+=In2+_U_THS4524_Fully_Diff In3+=In3+_U_THS4524_Fully_Diff In4+=In4+_U_THS4524_Fully_Diff out1_n=IN_B5_N out1_p=IN_B5_P out2_n=IN_B6_N out2_p=IN_B6_P out3_n=IN_B7_N out3_p=IN_B7_P out4_n=IN_B8_N out4_p=IN_B8_P PD1=PD1_U_THS4524_Fully_Diff PD2=PD2_U_THS4524_Fully_Diff PD3=PD3_U_THS4524_Fully_Diff PD4=PD4_U_THS4524_Fully_Diff Vocm=Vocm
U_Analog/U_Analog_8Ch_C/U_4ch_A/U_THS4524_Fully_Diff: designators end in _5; ports In1+=In1+_U_THS4524_Fully_Diff In2+=In2+_U_THS4524_Fully_Diff In3+=In3+_U_THS4524_Fully_Diff In4+=In4+_U_THS4524_Fully_Diff out1_n=IN_C1_N out1_p=IN_C1_P out2_n=IN_C2_N out2_p=IN_C2_P out3_n=IN_C3_N out3_p=IN_C3_P out4_n=IN_C4_N out4_p=IN_C4_P PD1=PD1_U_THS4524_Fully_Diff PD2=PD2_U_THS4524_Fully_Diff PD3=PD3_U_THS4524_Fully_Diff PD4=PD4_U_THS4524_Fully_Diff Vocm=Vocm
U_Analog/U_Analog_8Ch_C/U_4ch_B/U_THS4524_Fully_Diff: designators end in _6; ports In1+=In1+_U_THS4524_Fully_Diff In2+=In2+_U_THS4524_Fully_Diff In3+=In3+_U_THS4524_Fully_Diff In4+=In4+_U_THS4524_Fully_Diff out1_n=IN_C5_N out1_p=IN_C5_P out2_n=IN_C6_N out2_p=IN_C6_P out3_n=IN_C7_N out3_p=IN_C7_P out4_n=IN_C8_N out4_p=IN_C8_P PD1=PD1_U_THS4524_Fully_Diff PD2=PD2_U_THS4524_Fully_Diff PD3=PD3_U_THS4524_Fully_Diff PD4=PD4_U_THS4524_Fully_Diff Vocm=Vocm
U_Analog/U_Analog_8Ch_D/U_4ch_A/U_THS4524_Fully_Diff: designators end in _7; ports In1+=In1+_U_THS4524_Fully_Diff In2+=In2+_U_THS4524_Fully_Diff In3+=In3+_U_THS4524_Fully_Diff In4+=In4+_U_THS4524_Fully_Diff out1_n=IN_D1_N out1_p=IN_D1_P out2_n=IN_D2_N out2_p=IN_D2_P out3_n=IN_D3_N out3_p=IN_D3_P out4_n=IN_D4_N out4_p=IN_D4_P PD1=PD1_U_THS4524_Fully_Diff PD2=PD2_U_THS4524_Fully_Diff PD3=PD3_U_THS4524_Fully_Diff PD4=PD4_U_THS4524_Fully_Diff Vocm=Vocm
U_Analog/U_Analog_8Ch_D/U_4ch_B/U_THS4524_Fully_Diff: designators end in _8; ports In1+=In1+_U_THS4524_Fully_Diff In2+=In2+_U_THS4524_Fully_Diff In3+=In3+_U_THS4524_Fully_Diff In4+=In4+_U_THS4524_Fully_Diff out1_n=IN_D5_N out1_p=IN_D5_P out2_n=IN_D6_N out2_p=IN_D6_P out3_n=IN_D7_N out3_p=IN_D7_P out4_n=IN_D8_N out4_p=IN_D8_P PD1=PD1_U_THS4524_Fully_Diff PD2=PD2_U_THS4524_Fully_Diff PD3=PD3_U_THS4524_Fully_Diff PD4=PD4_U_THS4524_Fully_Diff Vocm=Vocm

### Notes on the sheet
- (near R27) default acceso
- Project Name:
- Revision:
- File Name:
- Date:
- Nuclear Instruments srl
- Via Lecco, 16, Lambrugo, Italy
- +39 031 2289570
- info@nuclearinstruments.eu
- http://www.nuclearinstruments.eu

### Library data of the parts
C17 C18 C21-C24 C27 C28 = CAPCER0402_X7R_50V_1n5: NICode: 00650002879; NIClass: Standard
C19 C20 C25 C26 C29-C31 = CAPCER0402_X7R_50V_100n: NICode: 00650000173; NIClass: Standard
C32-C34 = CAPCER0402_X5R_10V_1u: NICode: 00650000182; NIClass: Standard
R17-R20 R25 R26 R29-R34 R39 R40 R43 R44 = RES0402-1k: NICode: 00300000046; NIClass: Standard
R21-R24 R35-R38 = RES0402-49R9: NICode: 00300000035; NIClass: Standard
R27 R28 R41 R42 = RES0402-4k7: NICode: 00300000057; NIClass: Standard
U5 = THS4524IDBTR: NICode: 00890002878; NIClass: Standard

## Sheet Vocm_Gen.SchDoc
size A4; Organization: Altium Limited; Address1: L3, 12a Rodborough Rd; Address2: Frenchs Forest; Address3: NSW; Address4: Australia 2086
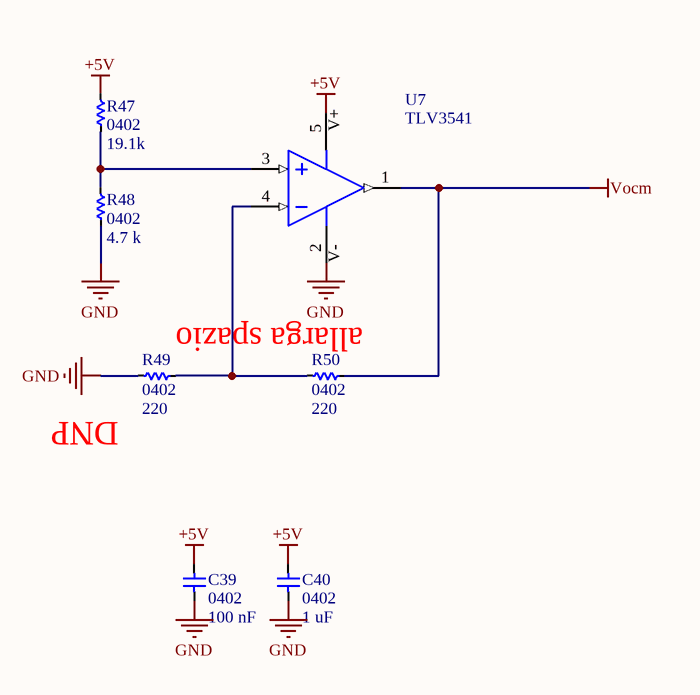
[diagram p7: Vocm_Gen.SchDoc]

### Parts
C39  0402  value 100 nF  [CAPCERSMD0402]
C40  0402  value 1 uF  [CAPCERSMD0402]
R47  0402  value 19.1k  [RESSMD0402]
R48  0402  value 4.7 k  [RESSMD0402]
R49  0402  value 220  [RESSMD0402]
R50  0402  value 220  [RESSMD0402]
U7  TLV3541  [SOT5_P95W280L290H145]

### Nets
+5V: C39.2 C40.2 R47.1 U7.5(V+)
GND: C39.1 C40.1 R48.2 R49.1 U7.2(V-)
Vocm: R50.2 U7.1(OUT)
NetR47_2: R47.2 R48.1 U7.3(IN+)
NetR49_2: R49.2 R50.1 U7.4(IN-)

### Notes on the sheet
- (near R50) allarga spazio
- (near R49) DNP
- Project Name:
- Revision:
- File Name:
- Date:
- Nuclear Instruments srl
- Via Lecco, 16, Lambrugo, Italy
- +39 031 2289570
- info@nuclearinstruments.eu
- http://www.nuclearinstruments.eu

### Library data of the parts
C39 = CAPCER0402_X7R_50V_100n: NICode: 00650000173; NIClass: Standard
C40 = CAPCER0402_X5R_10V_1u: NICode: 00650000182; NIClass: Standard
R47 = RES0402-19k1: NICode: 00300000367; NIClass: Standard
R48 = RES0402-4k7: NICode: 00300000057; NIClass: Standard
R49 R50 = RES0402-220R: NICode: 00300000040; NIClass: Standard
U7 = TLV3541IDBVT: TLV3541 200-MHz, Rail-to-Rail OPAMP; NICode: 00210000752; NIClass: Standard

## Nets that join several sheets
+5V: main (C43.1 FB5.2), U_Analog/U_Analog_8Ch_A/U_4ch_A/U_THS4524_Fully_Diff (14 pins), U_Analog/U_Analog_8Ch_A/U_4ch_B/U_THS4524_Fully_Diff (14 pins), U_Analog/U_Analog_8Ch_B/U_4ch_A/U_THS4524_Fully_Diff (14 pins), U_Analog/U_Analog_8Ch_B/U_4ch_B/U_THS4524_Fully_Diff (14 pins), U_Analog/U_Analog_8Ch_C/U_4ch_A/U_THS4524_Fully_Diff (14 pins), U_Analog/U_Analog_8Ch_C/U_4ch_B/U_THS4524_Fully_Diff (14 pins), U_Analog/U_Analog_8Ch_D/U_4ch_A/U_THS4524_Fully_Diff (14 pins), U_Analog/U_Analog_8Ch_D/U_4ch_B/U_THS4524_Fully_Diff (14 pins), Vocm_Gen (C39.2 C40.2 R47.1 U7.5)
GND: main (C43.2 C44.2 P2.1), Mechanical (M3.1 M4.1 M5.1 M6.1), Eth_Conn (P5.2), U_Analog/U_Analog_8Ch_A/U_4ch_A/U_THS4524_Fully_Diff (24 pins), U_Analog/U_Analog_8Ch_A/U_4ch_B/U_THS4524_Fully_Diff (24 pins), U_Analog/U_Analog_8Ch_B/U_4ch_A/U_THS4524_Fully_Diff (24 pins), U_Analog/U_Analog_8Ch_B/U_4ch_B/U_THS4524_Fully_Diff (24 pins), U_Analog/U_Analog_8Ch_C/U_4ch_A/U_THS4524_Fully_Diff (24 pins), U_Analog/U_Analog_8Ch_C/U_4ch_B/U_THS4524_Fully_Diff (24 pins), U_Analog/U_Analog_8Ch_D/U_4ch_A/U_THS4524_Fully_Diff (24 pins), U_Analog/U_Analog_8Ch_D/U_4ch_B/U_THS4524_Fully_Diff (24 pins), Vocm_Gen (5 pins)
Vocm: U_Analog/U_Analog_8Ch_A/U_4ch_A/U_THS4524_Fully_Diff (8 pins), U_Analog/U_Analog_8Ch_A/U_4ch_B/U_THS4524_Fully_Diff (8 pins), U_Analog/U_Analog_8Ch_B/U_4ch_A/U_THS4524_Fully_Diff (8 pins), U_Analog/U_Analog_8Ch_B/U_4ch_B/U_THS4524_Fully_Diff (8 pins), U_Analog/U_Analog_8Ch_C/U_4ch_A/U_THS4524_Fully_Diff (8 pins), U_Analog/U_Analog_8Ch_C/U_4ch_B/U_THS4524_Fully_Diff (8 pins), U_Analog/U_Analog_8Ch_D/U_4ch_A/U_THS4524_Fully_Diff (8 pins), U_Analog/U_Analog_8Ch_D/U_4ch_B/U_THS4524_Fully_Diff (8 pins), Vocm_Gen (R50.2 U7.1)
IN_A1_N: Eth_Conn (J1.E8), U_Analog/U_Analog_8Ch_A/U_4ch_A/U_THS4524_Fully_Diff (R17_1.2 R21_1.2)
IN_A1_P: Eth_Conn (J1.E7), U_Analog/U_Analog_8Ch_A/U_4ch_A/U_THS4524_Fully_Diff (R23_1.2 R29_1.2)
IN_A2_N: Eth_Conn (J1.E6), U_Analog/U_Analog_8Ch_A/U_4ch_A/U_THS4524_Fully_Diff (R18_1.2 R22_1.2)
IN_A2_P: Eth_Conn (J1.E3), U_Analog/U_Analog_8Ch_A/U_4ch_A/U_THS4524_Fully_Diff (R24_1.2 R30_1.2)
IN_A3_N: Eth_Conn (J1.E5), U_Analog/U_Analog_8Ch_A/U_4ch_A/U_THS4524_Fully_Diff (R31_1.2 R35_1.2)
IN_A3_P: Eth_Conn (J1.E4), U_Analog/U_Analog_8Ch_A/U_4ch_A/U_THS4524_Fully_Diff (R37_1.2 R43_1.2)
IN_A4_N: Eth_Conn (J1.E2), U_Analog/U_Analog_8Ch_A/U_4ch_A/U_THS4524_Fully_Diff (R32_1.2 R36_1.2)
IN_A4_P: Eth_Conn (J1.E1), U_Analog/U_Analog_8Ch_A/U_4ch_A/U_THS4524_Fully_Diff (R38_1.2 R44_1.2)
IN_A5_N: Eth_Conn (J1.A8), U_Analog/U_Analog_8Ch_A/U_4ch_B/U_THS4524_Fully_Diff (R17_2.2 R21_2.2)
IN_A5_P: Eth_Conn (J1.A7), U_Analog/U_Analog_8Ch_A/U_4ch_B/U_THS4524_Fully_Diff (R23_2.2 R29_2.2)
IN_A6_N: Eth_Conn (J1.A6), U_Analog/U_Analog_8Ch_A/U_4ch_B/U_THS4524_Fully_Diff (R18_2.2 R22_2.2)
IN_A6_P: Eth_Conn (J1.A3), U_Analog/U_Analog_8Ch_A/U_4ch_B/U_THS4524_Fully_Diff (R24_2.2 R30_2.2)
IN_A7_N: Eth_Conn (J1.A5), U_Analog/U_Analog_8Ch_A/U_4ch_B/U_THS4524_Fully_Diff (R31_2.2 R35_2.2)
IN_A7_P: Eth_Conn (J1.A4), U_Analog/U_Analog_8Ch_A/U_4ch_B/U_THS4524_Fully_Diff (R37_2.2 R43_2.2)
IN_A8_N: Eth_Conn (J1.A2), U_Analog/U_Analog_8Ch_A/U_4ch_B/U_THS4524_Fully_Diff (R32_2.2 R36_2.2)
IN_A8_P: Eth_Conn (J1.A1), U_Analog/U_Analog_8Ch_A/U_4ch_B/U_THS4524_Fully_Diff (R38_2.2 R44_2.2)
IN_B1_N: Eth_Conn (J1.F8), U_Analog/U_Analog_8Ch_B/U_4ch_A/U_THS4524_Fully_Diff (R17_3.2 R21_3.2)
IN_B1_P: Eth_Conn (J1.F7), U_Analog/U_Analog_8Ch_B/U_4ch_A/U_THS4524_Fully_Diff (R23_3.2 R29_3.2)
IN_B2_N: Eth_Conn (J1.F6), U_Analog/U_Analog_8Ch_B/U_4ch_A/U_THS4524_Fully_Diff (R18_3.2 R22_3.2)
IN_B2_P: Eth_Conn (J1.F3), U_Analog/U_Analog_8Ch_B/U_4ch_A/U_THS4524_Fully_Diff (R24_3.2 R30_3.2)
IN_B3_N: Eth_Conn (J1.F5), U_Analog/U_Analog_8Ch_B/U_4ch_A/U_THS4524_Fully_Diff (R31_3.2 R35_3.2)
IN_B3_P: Eth_Conn (J1.F4), U_Analog/U_Analog_8Ch_B/U_4ch_A/U_THS4524_Fully_Diff (R37_3.2 R43_3.2)
IN_B4_N: Eth_Conn (J1.F2), U_Analog/U_Analog_8Ch_B/U_4ch_A/U_THS4524_Fully_Diff (R32_3.2 R36_3.2)
IN_B4_P: Eth_Conn (J1.F1), U_Analog/U_Analog_8Ch_B/U_4ch_A/U_THS4524_Fully_Diff (R38_3.2 R44_3.2)
IN_B5_N: Eth_Conn (J1.B8), U_Analog/U_Analog_8Ch_B/U_4ch_B/U_THS4524_Fully_Diff (R17_4.2 R21_4.2)
IN_B5_P: Eth_Conn (J1.B7), U_Analog/U_Analog_8Ch_B/U_4ch_B/U_THS4524_Fully_Diff (R23_4.2 R29_4.2)
IN_B6_N: Eth_Conn (J1.B6), U_Analog/U_Analog_8Ch_B/U_4ch_B/U_THS4524_Fully_Diff (R18_4.2 R22_4.2)
IN_B6_P: Eth_Conn (J1.B3), U_Analog/U_Analog_8Ch_B/U_4ch_B/U_THS4524_Fully_Diff (R24_4.2 R30_4.2)
IN_B7_N: Eth_Conn (J1.B5), U_Analog/U_Analog_8Ch_B/U_4ch_B/U_THS4524_Fully_Diff (R31_4.2 R35_4.2)
IN_B7_P: Eth_Conn (J1.B4), U_Analog/U_Analog_8Ch_B/U_4ch_B/U_THS4524_Fully_Diff (R37_4.2 R43_4.2)
IN_B8_N: Eth_Conn (J1.B2), U_Analog/U_Analog_8Ch_B/U_4ch_B/U_THS4524_Fully_Diff (R32_4.2 R36_4.2)
IN_B8_P: Eth_Conn (J1.B1), U_Analog/U_Analog_8Ch_B/U_4ch_B/U_THS4524_Fully_Diff (R38_4.2 R44_4.2)
IN_C1_N: Eth_Conn (J1.G8), U_Analog/U_Analog_8Ch_C/U_4ch_A/U_THS4524_Fully_Diff (R17_5.2 R21_5.2)
IN_C1_P: Eth_Conn (J1.G7), U_Analog/U_Analog_8Ch_C/U_4ch_A/U_THS4524_Fully_Diff (R23_5.2 R29_5.2)
IN_C2_N: Eth_Conn (J1.G6), U_Analog/U_Analog_8Ch_C/U_4ch_A/U_THS4524_Fully_Diff (R18_5.2 R22_5.2)
IN_C2_P: Eth_Conn (J1.G3), U_Analog/U_Analog_8Ch_C/U_4ch_A/U_THS4524_Fully_Diff (R24_5.2 R30_5.2)
IN_C3_N: Eth_Conn (J1.G5), U_Analog/U_Analog_8Ch_C/U_4ch_A/U_THS4524_Fully_Diff (R31_5.2 R35_5.2)
IN_C3_P: Eth_Conn (J1.G4), U_Analog/U_Analog_8Ch_C/U_4ch_A/U_THS4524_Fully_Diff (R37_5.2 R43_5.2)
IN_C4_N: Eth_Conn (J1.G2), U_Analog/U_Analog_8Ch_C/U_4ch_A/U_THS4524_Fully_Diff (R32_5.2 R36_5.2)
IN_C4_P: Eth_Conn (J1.G1), U_Analog/U_Analog_8Ch_C/U_4ch_A/U_THS4524_Fully_Diff (R38_5.2 R44_5.2)
IN_C5_N: Eth_Conn (J1.C8), U_Analog/U_Analog_8Ch_C/U_4ch_B/U_THS4524_Fully_Diff (R17_6.2 R21_6.2)
IN_C5_P: Eth_Conn (J1.C7), U_Analog/U_Analog_8Ch_C/U_4ch_B/U_THS4524_Fully_Diff (R23_6.2 R29_6.2)
IN_C6_N: Eth_Conn (J1.C6), U_Analog/U_Analog_8Ch_C/U_4ch_B/U_THS4524_Fully_Diff (R18_6.2 R22_6.2)
IN_C6_P: Eth_Conn (J1.C3), U_Analog/U_Analog_8Ch_C/U_4ch_B/U_THS4524_Fully_Diff (R24_6.2 R30_6.2)
IN_C7_N: Eth_Conn (J1.C5), U_Analog/U_Analog_8Ch_C/U_4ch_B/U_THS4524_Fully_Diff (R31_6.2 R35_6.2)
IN_C7_P: Eth_Conn (J1.C4), U_Analog/U_Analog_8Ch_C/U_4ch_B/U_THS4524_Fully_Diff (R37_6.2 R43_6.2)
IN_C8_N: Eth_Conn (J1.C2), U_Analog/U_Analog_8Ch_C/U_4ch_B/U_THS4524_Fully_Diff (R32_6.2 R36_6.2)
IN_C8_P: Eth_Conn (J1.C1), U_Analog/U_Analog_8Ch_C/U_4ch_B/U_THS4524_Fully_Diff (R38_6.2 R44_6.2)
IN_D1_N: Eth_Conn (J1.H8), U_Analog/U_Analog_8Ch_D/U_4ch_A/U_THS4524_Fully_Diff (R17_7.2 R21_7.2)
IN_D1_P: Eth_Conn (J1.H7), U_Analog/U_Analog_8Ch_D/U_4ch_A/U_THS4524_Fully_Diff (R23_7.2 R29_7.2)
IN_D2_N: Eth_Conn (J1.H6), U_Analog/U_Analog_8Ch_D/U_4ch_A/U_THS4524_Fully_Diff (R18_7.2 R22_7.2)
IN_D2_P: Eth_Conn (J1.H3), U_Analog/U_Analog_8Ch_D/U_4ch_A/U_THS4524_Fully_Diff (R24_7.2 R30_7.2)
IN_D3_N: Eth_Conn (J1.H5), U_Analog/U_Analog_8Ch_D/U_4ch_A/U_THS4524_Fully_Diff (R31_7.2 R35_7.2)
IN_D3_P: Eth_Conn (J1.H4), U_Analog/U_Analog_8Ch_D/U_4ch_A/U_THS4524_Fully_Diff (R37_7.2 R43_7.2)
IN_D4_N: Eth_Conn (J1.H2), U_Analog/U_Analog_8Ch_D/U_4ch_A/U_THS4524_Fully_Diff (R32_7.2 R36_7.2)
IN_D4_P: Eth_Conn (J1.H1), U_Analog/U_Analog_8Ch_D/U_4ch_A/U_THS4524_Fully_Diff (R38_7.2 R44_7.2)
IN_D5_N: Eth_Conn (J1.D8), U_Analog/U_Analog_8Ch_D/U_4ch_B/U_THS4524_Fully_Diff (R17_8.2 R21_8.2)
IN_D5_P: Eth_Conn (J1.D7), U_Analog/U_Analog_8Ch_D/U_4ch_B/U_THS4524_Fully_Diff (R23_8.2 R29_8.2)
IN_D6_N: Eth_Conn (J1.D6), U_Analog/U_Analog_8Ch_D/U_4ch_B/U_THS4524_Fully_Diff (R18_8.2 R22_8.2)
IN_D6_P: Eth_Conn (J1.D3), U_Analog/U_Analog_8Ch_D/U_4ch_B/U_THS4524_Fully_Diff (R24_8.2 R30_8.2)
IN_D7_N: Eth_Conn (J1.D5), U_Analog/U_Analog_8Ch_D/U_4ch_B/U_THS4524_Fully_Diff (R31_8.2 R35_8.2)
IN_D7_P: Eth_Conn (J1.D4), U_Analog/U_Analog_8Ch_D/U_4ch_B/U_THS4524_Fully_Diff (R37_8.2 R43_8.2)
IN_D8_N: Eth_Conn (J1.D2), U_Analog/U_Analog_8Ch_D/U_4ch_B/U_THS4524_Fully_Diff (R32_8.2 R36_8.2)
IN_D8_P: Eth_Conn (J1.D1), U_Analog/U_Analog_8Ch_D/U_4ch_B/U_THS4524_Fully_Diff (R38_8.2 R44_8.2)

## Assembly variants
R5560_Test_Board_rev1A: not fitted C43 C44 FB5 FB6 P2 R45_1 R45_2 R45_3 R45_4 R51_1 R51_2 R51_3 R51_4 R52 R53